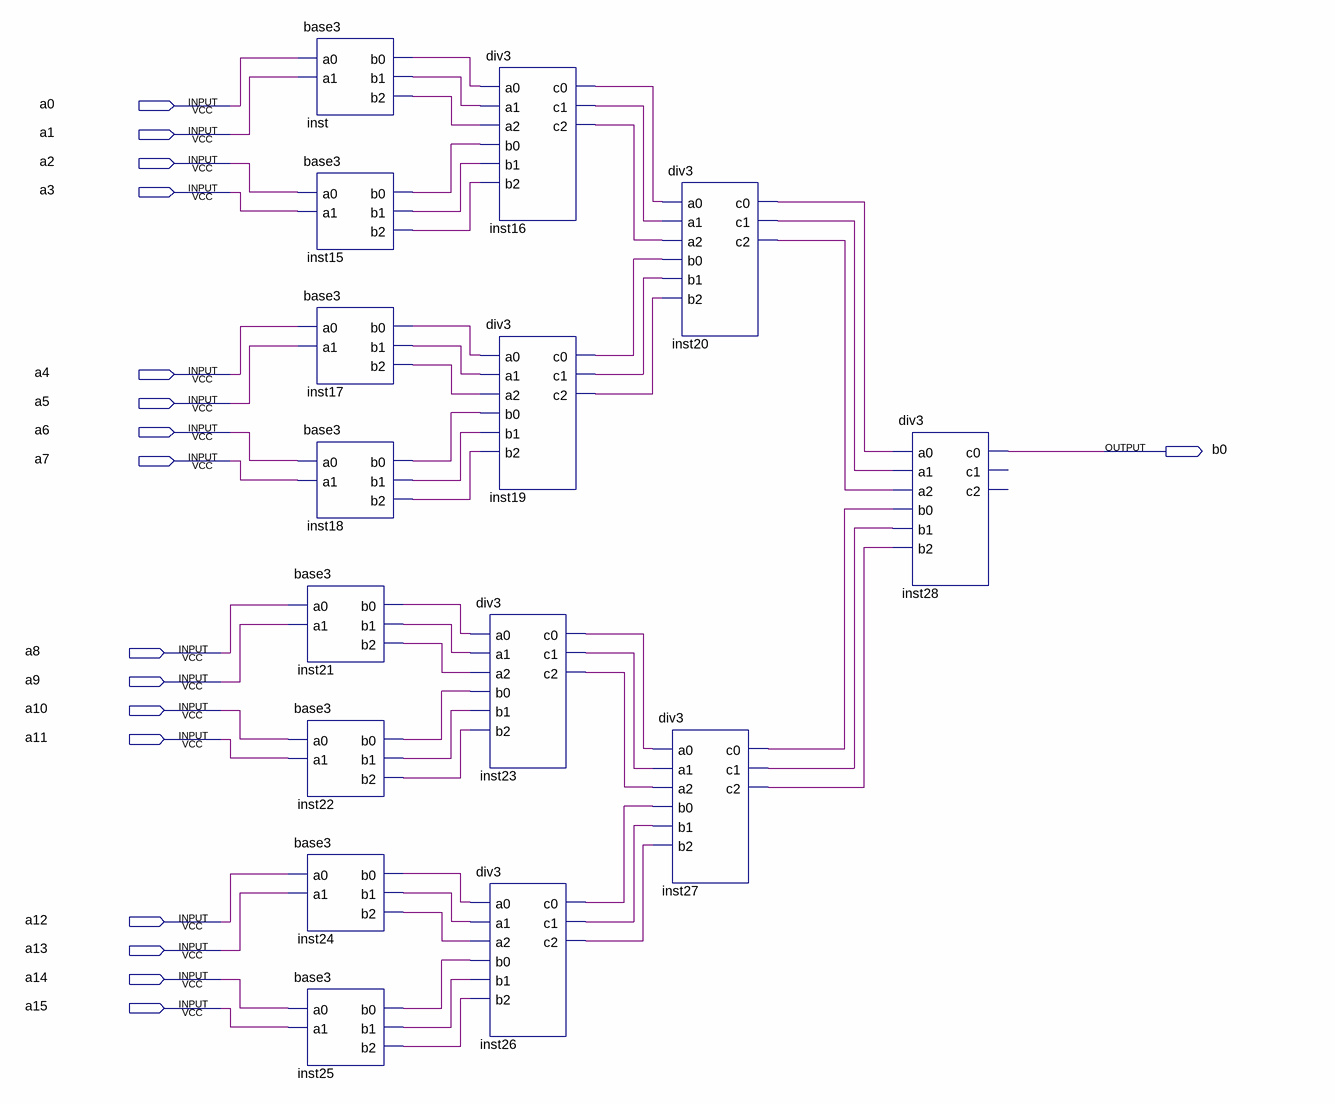
[diagram p0: schematic sheet]
// Quartus schematic LabI.bdf as structural Verilog: 15 symbols, 17 pins
module LabI (
  input  a0,
  input  a1,
  input  a2,
  input  a3,
  input  a4,
  input  a5,
  input  a6,
  input  a7,
  input  a8,
  input  a9,
  input  a10,
  input  a11,
  input  a12,
  input  a13,
  input  a14,
  input  a15,
  output b0
);

  wire inst15_b0, inst15_b1, inst15_b2, inst16_c0, inst16_c1, inst16_c2, inst17_b0, inst17_b1, inst17_b2,
       inst18_b0, inst18_b1, inst18_b2, inst19_c0, inst19_c1, inst19_c2, inst20_c0, inst20_c1, inst20_c2,
       inst21_b0, inst21_b1, inst21_b2, inst22_b0, inst22_b1, inst22_b2, inst23_c0, inst23_c1, inst23_c2,
       inst24_b0, inst24_b1, inst24_b2, inst25_b0, inst25_b1, inst25_b2, inst26_c0, inst26_c1, inst26_c2,
       inst27_c0, inst27_c1, inst27_c2, inst_b0, inst_b1, inst_b2;

  base3 inst (.a0(a0), .a1(a1), .b0(inst_b0), .b1(inst_b1), .b2(inst_b2));
  base3 inst15 (.a0(a2), .a1(a3), .b0(inst15_b0), .b1(inst15_b1), .b2(inst15_b2));
  base3 inst17 (.a0(a4), .a1(a5), .b0(inst17_b0), .b1(inst17_b1), .b2(inst17_b2));
  base3 inst18 (.a0(a6), .a1(a7), .b0(inst18_b0), .b1(inst18_b1), .b2(inst18_b2));
  base3 inst21 (.a0(a8), .a1(a9), .b0(inst21_b0), .b1(inst21_b1), .b2(inst21_b2));
  base3 inst22 (.a0(a10), .a1(a11), .b0(inst22_b0), .b1(inst22_b1), .b2(inst22_b2));
  base3 inst24 (.a0(a12), .a1(a13), .b0(inst24_b0), .b1(inst24_b1), .b2(inst24_b2));
  base3 inst25 (.a0(a14), .a1(a15), .b0(inst25_b0), .b1(inst25_b1), .b2(inst25_b2));
  div3 inst16 (
    .a0(inst_b0), .a1(inst_b1), .a2(inst_b2), .b0(inst15_b0), .b1(inst15_b1), .b2(inst15_b2), .c0(inst16_c0),
    .c1(inst16_c1), .c2(inst16_c2));
  div3 inst19 (
    .a0(inst17_b0), .a1(inst17_b1), .a2(inst17_b2), .b0(inst18_b0), .b1(inst18_b1), .b2(inst18_b2),
    .c0(inst19_c0), .c1(inst19_c1), .c2(inst19_c2));
  div3 inst23 (
    .a0(inst21_b0), .a1(inst21_b1), .a2(inst21_b2), .b0(inst22_b0), .b1(inst22_b1), .b2(inst22_b2),
    .c0(inst23_c0), .c1(inst23_c1), .c2(inst23_c2));
  div3 inst26 (
    .a0(inst24_b0), .a1(inst24_b1), .a2(inst24_b2), .b0(inst25_b0), .b1(inst25_b1), .b2(inst25_b2),
    .c0(inst26_c0), .c1(inst26_c1), .c2(inst26_c2));
  div3 inst20 (
    .a0(inst16_c0), .a1(inst16_c1), .a2(inst16_c2), .b0(inst19_c0), .b1(inst19_c1), .b2(inst19_c2),
    .c0(inst20_c0), .c1(inst20_c1), .c2(inst20_c2));
  div3 inst27 (
    .a0(inst23_c0), .a1(inst23_c1), .a2(inst23_c2), .b0(inst26_c0), .b1(inst26_c1), .b2(inst26_c2),
    .c0(inst27_c0), .c1(inst27_c1), .c2(inst27_c2));
  div3 inst28 (
    .a0(inst20_c0), .a1(inst20_c1), .a2(inst20_c2), .b0(inst27_c0), .b1(inst27_c1), .b2(inst27_c2), .c0(b0));  // open: c1, c2
endmodule
